# EasyEDA Pro project hexcooler_v2.epro

# Schematic Schematic1
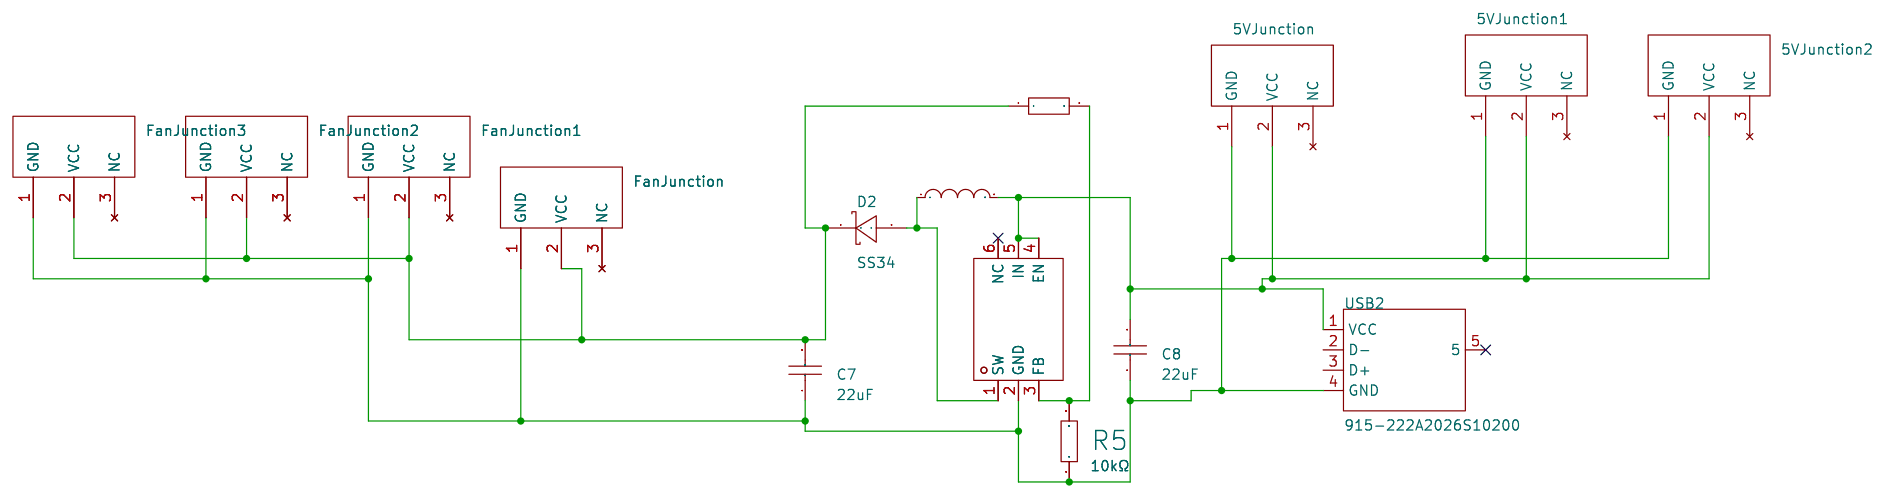
[diagram p0: schematic sheet]

## Parts
5VJunction  -  [pads junction]
5VJunction1  -  [pads junction]
5VJunction2  -  [pads junction]
C7  22uF  [C1206]
C8  22uF  [C1206]
D2  SS34  [SMA_L4.3-W2.6-LS5.2-RD]
FanJunction  -  [pads junction]
FanJunction1  -  [pads junction]
FanJunction2  -  [pads junction]
FanJunction3  -  [pads junction]
L1  4.7uH  [IND-SMD_L3.0-W3.0_LQH3NPN2R2NG0L]
R3  200kΩ  [R0805]
R5  10kΩ  [R0603]
U3  MT3608  [SOT-23-6_L2.9-W1.6-P0.95-LS2.8-BL]
USB2  915-222A2026S10200  [USB-A-SMD_915-222A2026S10200]

## Library data of the parts
5VJunction 5VJunction1 5VJunction2 FanJunction FanJunction1-FanJunction3 = connector for m y fan
C7 C8 = CL31A226KAHNNNE: Capacitance:22uF Tolerance:±10% Tolerance:±10% Voltage Rating:25V Temperature Coefficient:X5R; LCSC Part Name: 22uF ±10% 25V; Supplier Part: C12891; Manufacturer: SAMSUNG(三星); Supplier Footprint: 1206; JLCPCB Part Class: Basic Part; Datasheet: https://item.szlcsc.com/datasheet/CL31A226KAHNNNE/13537.html; Supplier: LCSC; Tolerance: ±10%; Voltage Rating: 25V; Temperature Coefficient: X5R
D2 = SS34_C8678: Diode Configuration:Independent Voltage - Forward(Vf@If):550mV@3A Voltage - DC Reverse(Vr):40V Current - Rectified:3A Reverse Leakage Current (Ir):500uA@40V Operating Junction Temperature Range:-55℃~+125℃ Operating Junction Temperature Range:-55℃~+125℃; LCSC Part Name: 电压:40V 电流:3A; Supplier Part: C8678; Manufacturer: MDD(辰达半导体); Supplier Footprint: SMA(DO-214AC); JLCPCB Part Class: Basic Part; Datasheet: https://item.szlcsc.com/datasheet/SS34/9178.html; Supplier: LCSC; Diode Configuration: Independent; Voltage - Forward(Vf@If): 550mV@3A; Voltage - DC Reverse(Vr): 40V; Current - Rectified: 3A; Reverse Leakage Current (Ir): 500uA@40V; Operating Junction Temperature Range: -55℃~+125℃
L1 = LQH3NPN4R7MJRL: Inductance:4.7uH Tolerance:±20% Tolerance:±20% Current Rating:- Current - Saturation (Isat):- DC Resistance(DCR):120mΩ Q @ Frequency:- Frequency - Self Resonant:40MHz Ratings:-; LCSC Part Name: 4.7uH ±20%; Supplier Part: C668452; Manufacturer: muRata(村田); Supplier Footprint: SMD,3x3mm; JLCPCB Part Class: Extended Part; Datasheet: https://item.szlcsc.com/datasheet/LQH3NPN4R7MJRL/698341.html; Supplier: LCSC; Tolerance: ±20%; DC Resistance(DCR): 120mΩ; Frequency - Self Resonant: 40MHz
R3 = 0805W8F2003T5E: Type:Thick Film Resistors Resistance:200kΩ Tolerance:±1% Tolerance:±1% Power(Watts): Overload Voltage (Max): Temperature Coefficient:±100ppm/℃ Temperature Coefficient:±100ppm/℃ Operating Temperature Range:-55℃~+155℃ Operating Temperature Range:-55℃~+155℃; LCSC Part Name: 200kΩ ±1% 125mW 厚膜电阻; Supplier Part: C17539; Manufacturer: UNI-ROYAL(厚声); Supplier Footprint: 0805; JLCPCB Part Class: Basic Part; Datasheet: https://atta.szlcsc.com/upload/public/pdf/source/20200306/C422600_1E6D84923E4A46A82E41ADD87F860B5C.pdf; Supplier: LCSC; Type: Thick Film Resistors; Tolerance: ±1%; Temperature Coefficient: ±100ppm/℃; Operating Temperature Range: -55℃~+155℃
R5 = 0603WAF1002T5E: Type:Thick Film Resistor Resistance:10kΩ Tolerance:±1% Tolerance:±1% Power(Watts):100mW Voltage-Supply(Max):75V Temperature Coefficient:±100ppm/℃ Temperature Coefficient:±100ppm/℃ Operating Temperature:-55℃~+155℃ Operating Temperature:-55℃~+155℃; LCSC Part Name: 厚膜电阻 10kΩ ±1% 100mW; Supplier Part: C25804; Manufacturer: UNI-ROYAL(厚声); Supplier Footprint: 0603; JLCPCB Part Class: Basic Part; Datasheet: https://item.szlcsc.com/datasheet/0603WAF1002T5E/26547.html; Supplier: LCSC; Type: Thick Film Resistor; Tolerance: ±1%; Power(Watts): 100mW; Voltage-Supply(Max): 75V; Temperature Coefficient: ±100ppm/℃; Operating Temperature: -55℃~+155℃
U3 = MT3608: Function:Boost Output Type:Adjustable Voltage - Supply:2V~24V Voltage - Supply:2V~24V Output Voltage:- Output Voltage:- Output Current:2A Frequency - Switching:1.2MHz Frequency - Switching:1.2MHz Operating Temperature:-40℃~+85℃ Operating Temperature:-40℃~; LCSC Part Name: 老版本 高效1.2MHz 2A升压转换器; Supplier Part: C84817; Manufacturer: 西安航天民芯; Supplier Footprint: SOT-23-6; JLCPCB Part Class: Extended Part; Datasheet: https://item.szlcsc.com/datasheet/MT3608/85988.html; Supplier: LCSC; Function: Boost; Output Type: Adjustable; Voltage - Supply: 2V~24V; Output Current: 2A; Frequency - Switching: 1.2MHz; Operating Temperature: -40℃~+85℃; Synchronous Rectifier: No; Number of Outputs: 1; Topology: Boost; Quiescent Current: 100uA；1.6mA; Switch tube (built-in/external): Built-in
USB2 = 915-222A2026S10200: Connector Type:Type-A Gender:Female Mounting Type:Surface Mount, Right Angle Number of Ports:1 Connect-Disconnect Life:1500 Cycles Length:10mm Detection color:Black Operating Temperature:-55℃~+85℃ Operating Temperature:-55℃~+85℃; LCSC Part Name: Type-A 母 卧贴; Supplier Part: C5336457; Manufacturer: 精拓金; Supplier Footprint: 插件; JLCPCB Part Class: Extended Part; Datasheet: https://item.szlcsc.com/datasheet/915-222A2026S10200/6101548.html; Supplier: LCSC; Connector Type: Type-A; Gender: Female; Mounting Type: Surface Mount, Right Angle; Number of Ports: 1; Connect-Disconnect Life: 1500 Cycles; Length: 10mm; Detection color: Black; Operating Temperature: -55℃~+85℃

## Nets
$1N1254: D2.2(A) L1.1 U3.1(SW)
$1N1369: R3.2 R5.2 U3.3(FB)
$1N3225: C7.2 D2.1(K) FanJunction.2(VCC) FanJunction1.2(VCC) FanJunction2.2(VCC) FanJunction3.2(VCC) R3.1
$1N5597: 5VJunction.1(GND) 5VJunction1.1(GND) 5VJunction2.1(GND) C7.1 C8.1 FanJunction.1(GND) FanJunction1.1(GND) FanJunction2.1(GND) FanJunction3.1(GND) R5.1 U3.2(GND) USB2.4(GND)
$1N5945: 5VJunction.2(VCC) 5VJunction1.2(VCC) 5VJunction2.2(VCC) C8.2 L1.2 U3.4(EN) U3.5(IN) USB2.1(VCC)

Not connected (* = marked no-connect by the designer): 5VJunction 3(NC); 5VJunction1 3(NC); 5VJunction2 3(NC); FanJunction 3(NC); FanJunction1 3(NC); FanJunction2 3(NC); FanJunction3 3(NC); U3 6(NC)*; USB2 2(D-) 3(D+) 5*

# Board PCB1
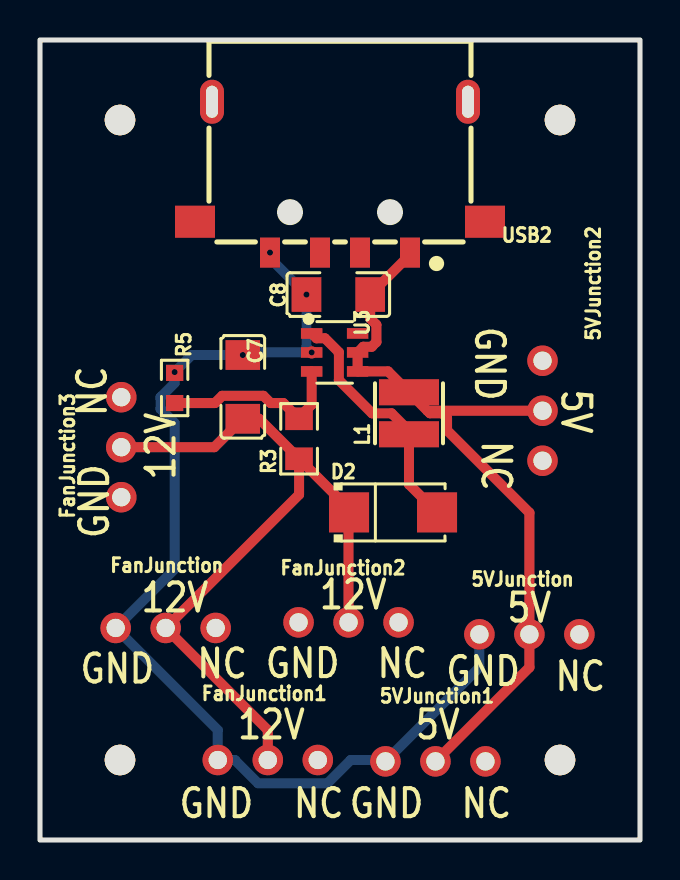
[diagram p1: board, top side]
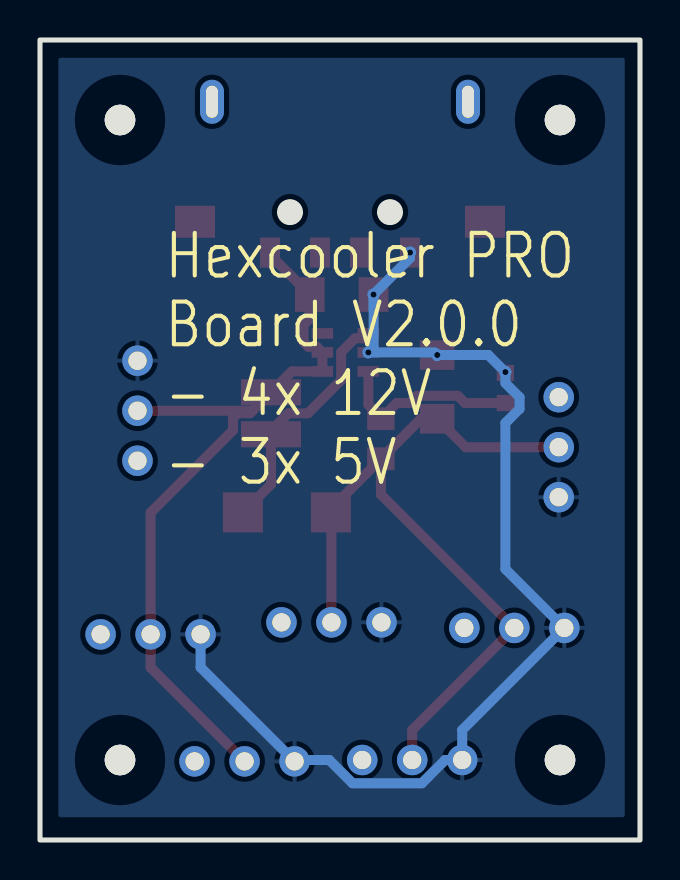
[diagram p2: board, bottom side, seen from below]

Outline 30 x 40 mm; copper layers: Top Layer, Bottom Layer. Coordinates in mm from the lower left corner of the outline.
Outline path: rectangle 0,40 30,0
Stack: Top Layer 0.035mm / Dielectric1 1.51mm FR4 er 4.5 / Bottom Layer 0.035mm

## Design rules (mm)
template: JLCPCB Capability(Two Layers Board)
spacing copperThickness1oz (default): track to track 0.102, other pairs 0.152 to 0.3
spacing copperThickness2oz: track to track 0.203, other pairs 0.152 to 0.3
track width copperThickness1oz (default): min 0.127, default 0.254, max 2.54
track width copperThickness2oz: min 0.203, default 0.254, max 2.54
differential pair differentialPair (default): width min 0.127, default 0.254, max 2.54; gap min 0.152, default 0.152
via viaSize (default): diameter min 0.5, default 0.61, max 10; hole min 0.3, default 0.305, max 6.3

## Placement (name value [footprint] x y rotation side)
5VJunction  -  [pads junction]  21.97 10.28 0 top
5VJunction1  -  [pads junction]  17.27 3.93 0 top
5VJunction2  -  [pads junction]  25.13 23.96 270 top
C7  22uF  [C1206]  10.14 22.66 270 top
C8  22uF  [C1206]  14.92 27.27 0 top
D2  SS34  [SMA_L4.3-W2.6-LS5.2-RD]  17.65 16.38 0 top
FanJunction  -  [pads junction]  3.78 10.6 0 top
FanJunction1  -  [pads junction]  8.89 4 0 top
FanJunction2  -  [pads junction]  12.93 10.88 0 top
FanJunction3  -  [pads junction]  4.06 17.14 90 top
L1  4.7uH  [IND-SMD_L3.0-W3.0_LQH3NPN2R2NG0L]  18.45 21.34 90 top
NOREF  -  [Pad_e18]  26 36 0 top
NOREF#2  -  [Pad_e56]  4 4 0 top
NOREF#3  -  [Pad_e57]  26 4 0 top
NOREF#4  -  [Pad_e17]  4 36 0 top
R3  200kΩ  [R0805]  12.95 20.06 90 top
R5  10kΩ  [R0603]  6.73 22.6 270 top
U3  MT3608  [SOT-23-6_L2.9-W1.6-P0.95-LS2.8-BL]  14.73 24.38 270 top
USB2  915-222A2026S10200  [USB-A-SMD_915-222A2026S10200]  15 33.14 180 top

## Footprints (pads in the part's own frame, mm; a bottom-side part is the same pattern mirrored in y, then rotated)
C1206
  rect 1.485x1.728 smd: 1(-1.593,0) 2(1.593,0)
IND-SMD_L3.0-W3.0_LQH3NPN2R2NG0L
  rect 1.3x3 smd: 1(-1.05,0) 2(1.05,0)
Pad_e17
  round 1.524 hole 6x4: 1(0,0)
Pad_e18
  round 1.524 hole 4: 2(0,0)
Pad_e56
  round 1.524 hole 4: 1(0,0)
Pad_e57
  round 1.524 hole 4: 1(0,0)
pads junction
  round 1.524 hole 0.914: 1(0,0) 2(2.5,0) 3(5,0)
R0603
  rect 0.806x0.864 smd: 1(-0.753,0) 2(0.753,0)
R0805
  rect 1.133x1.377 smd: 1(-1,0) 2(1,0)
SMA_L4.3-W2.6-LS5.2-RD
  rect 2x2 smd: 1(-2.2,0) 2(2.2,0)
SOT-23-6_L2.9-W1.6-P0.95-LS2.8-BL
  rect 0.532x1.072 smd: 1(-0.95,-1.149) 2(0,-1.149) 3(0.95,-1.149) 4(0.95,1.149) 5(0,1.149) 6(-0.95,1.149)
USB-A-SMD_915-222A2026S10200
  rect 1x1.5 smd: 1(-3.5,3.77) 2(-1,3.77) 3(1,3.77) 4(3.5,3.77)
  rect 2x1.6 smd: 5(-7.25,2.23) 5(7.25,2.23)
  oval 1.2x2.2 hole 0.6x1.6: 5(-6.4,-3.77) 5(6.4,-3.77)

## Nets
As in the schematic.

Pads without a net: 5VJunction 3; 5VJunction1 3; 5VJunction2 3; FanJunction 3; FanJunction1 3; FanJunction2 3; FanJunction3 3; NOREF 2; NOREF#2 1; NOREF#3 1; NOREF#4 1; U3 6; USB2 2 3 5

## Via types
v1: diameter 0.61, hole 0.305, Top Layer to Bottom Layer, 5 vias

## Routing (per net, layer and track width the routed paths; a pad name or vN(x,y) marks a point on that pad's centre or on a via; arc(x,y) is an arc through that point)
$1N1254: length 12.4
  Top Layer w0.5: D2.2 18.45,17.78 L1.1 18.45,20.46 17.58,21.33 16.61,21.33 14.94,23 14.94,24.39 14.25,25.09 13.83,25.09 13.58,25.33
$1N1369: length 9.4
  Top Layer w0.5: R5.2 8.75,21.85 9.11,22.21 11.17,22.21 11.53,21.85 12.17,21.85 R3.2 ; 12.95,21.14 13.58,21.77 U3.3
$1N3225: length 39.5
  Top Layer w0.5: FanJunction3.2 8.72,19.64 C7.2 10.95,21.06 R3.1 ; FanJunction1.2 11.39,5.5 FanJunction.2 12.95,17.27 R3.1 ; FanJunction2.2 15.43,16.35 D2.1 15.45,16.56 R3.1
$1N5597: length 54.1
  Bottom Layer w0.5: 5VJunction.1 21.97,8.63 5VJunction1.1 17.2,4 15.54,4 14.37,2.84 10.91,2.84 9.74,4 FanJunction1.1 8.89,5.5 FanJunction.1 6.73,13.55 6.73,20.85 6.02,21.56 6.02,22.14 6.73,22.85 v1(6.73,23.4) 7.58,24.25 v1(10.14,24.25) 10.27,24.38 v1(13.58,24.38) 13.32,24.64 v1(13.32,27.27) 11.5,29.1 v1(11.5,29.37)
$1N5945: length 39.5
  Top Layer w0.5: 5VJunction1.2 24.47,8.63 5VJunction.2 24.47,16.36 20.35,20.48 20.35,21.1 20.12,21.34 19.5,21.34 19.37,21.46 ; 19.37,21.46 5VJunction2.2 ; 19.37,21.46 L1.2 17.41,23.43 U3.4 U3.5 16.16,24.66 16.58,24.66 16.82,24.9 16.82,25.76 16.51,26.07 C8.2 18.5,29.26 USB2.1

## Copper pours and planes (outline as drawn; the poured copper is in the pictures)
$1N5597 on Bottom Layer: 0.76,39.11 29.08,39.11 29.08,1.14 0.76,1.14

## Text on the board
Bottom Silkscreen Layer: Hexcooler PRO / Board V2.0.0 / - 4x 12V / - 3x 5V
Top Silkscreen Layer: GND | 12V | NC | 5V
